# Altium project PC110.PrjPcb (part 5 of 5)

## Sheet DockStation.SchDoc
size 840 x 594 mm
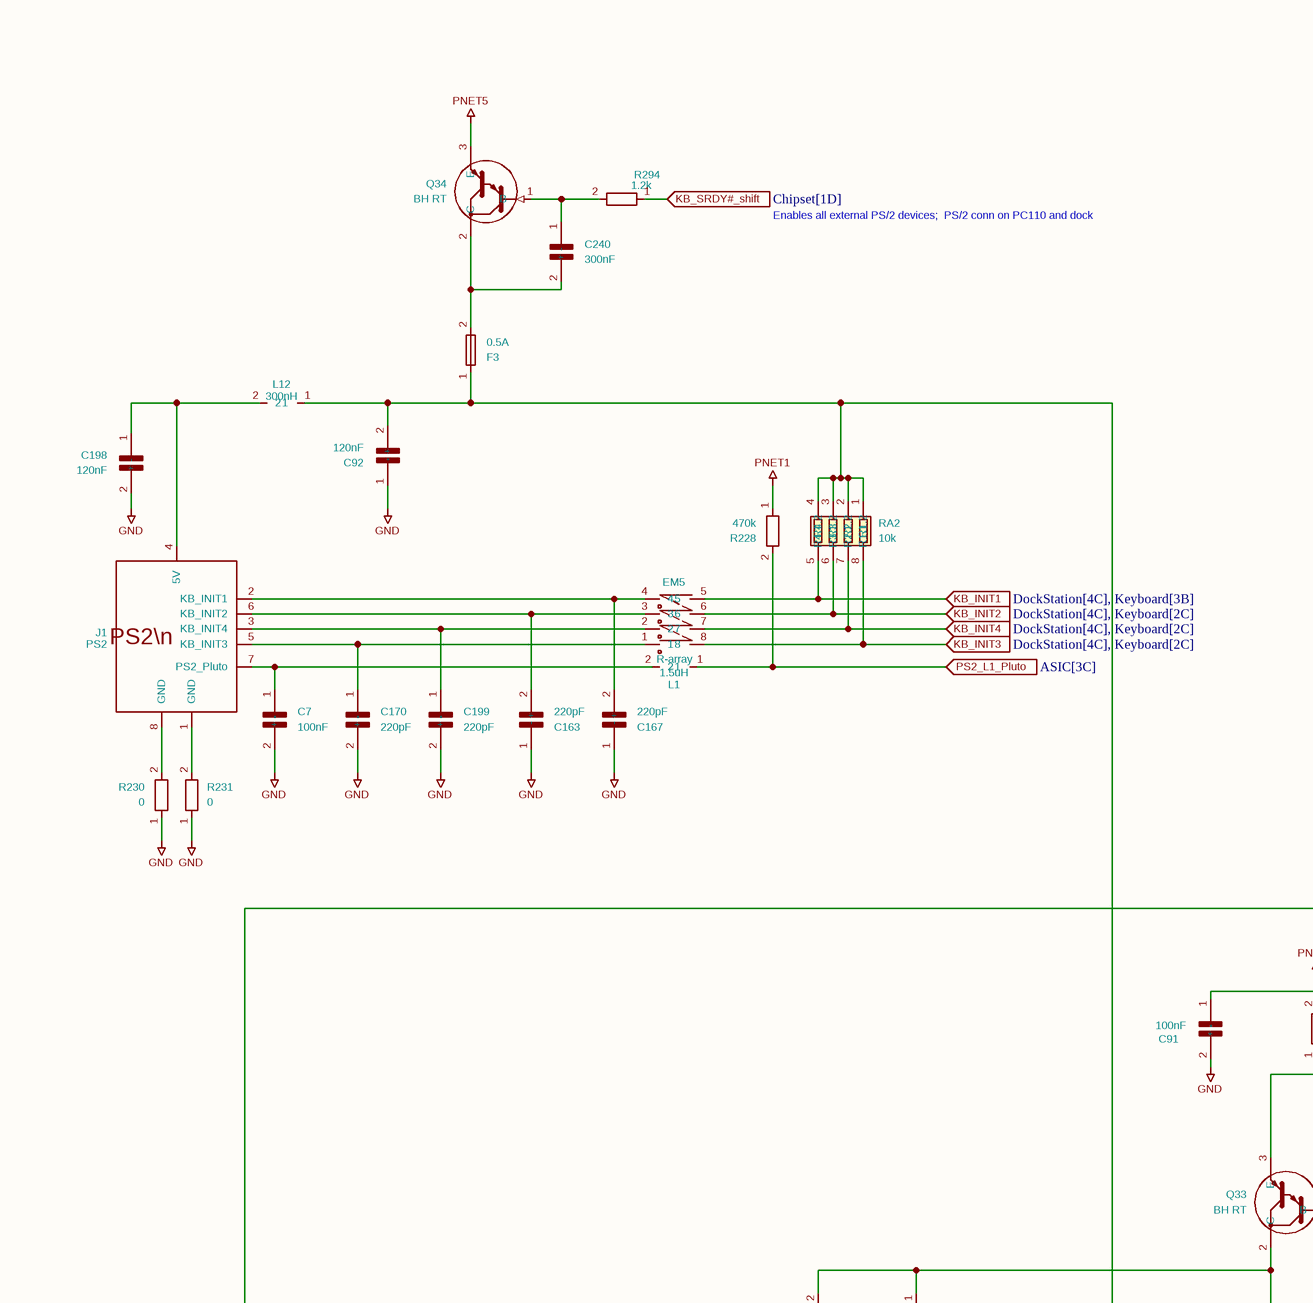
[diagram p46: DockStation.SchDoc, top left]
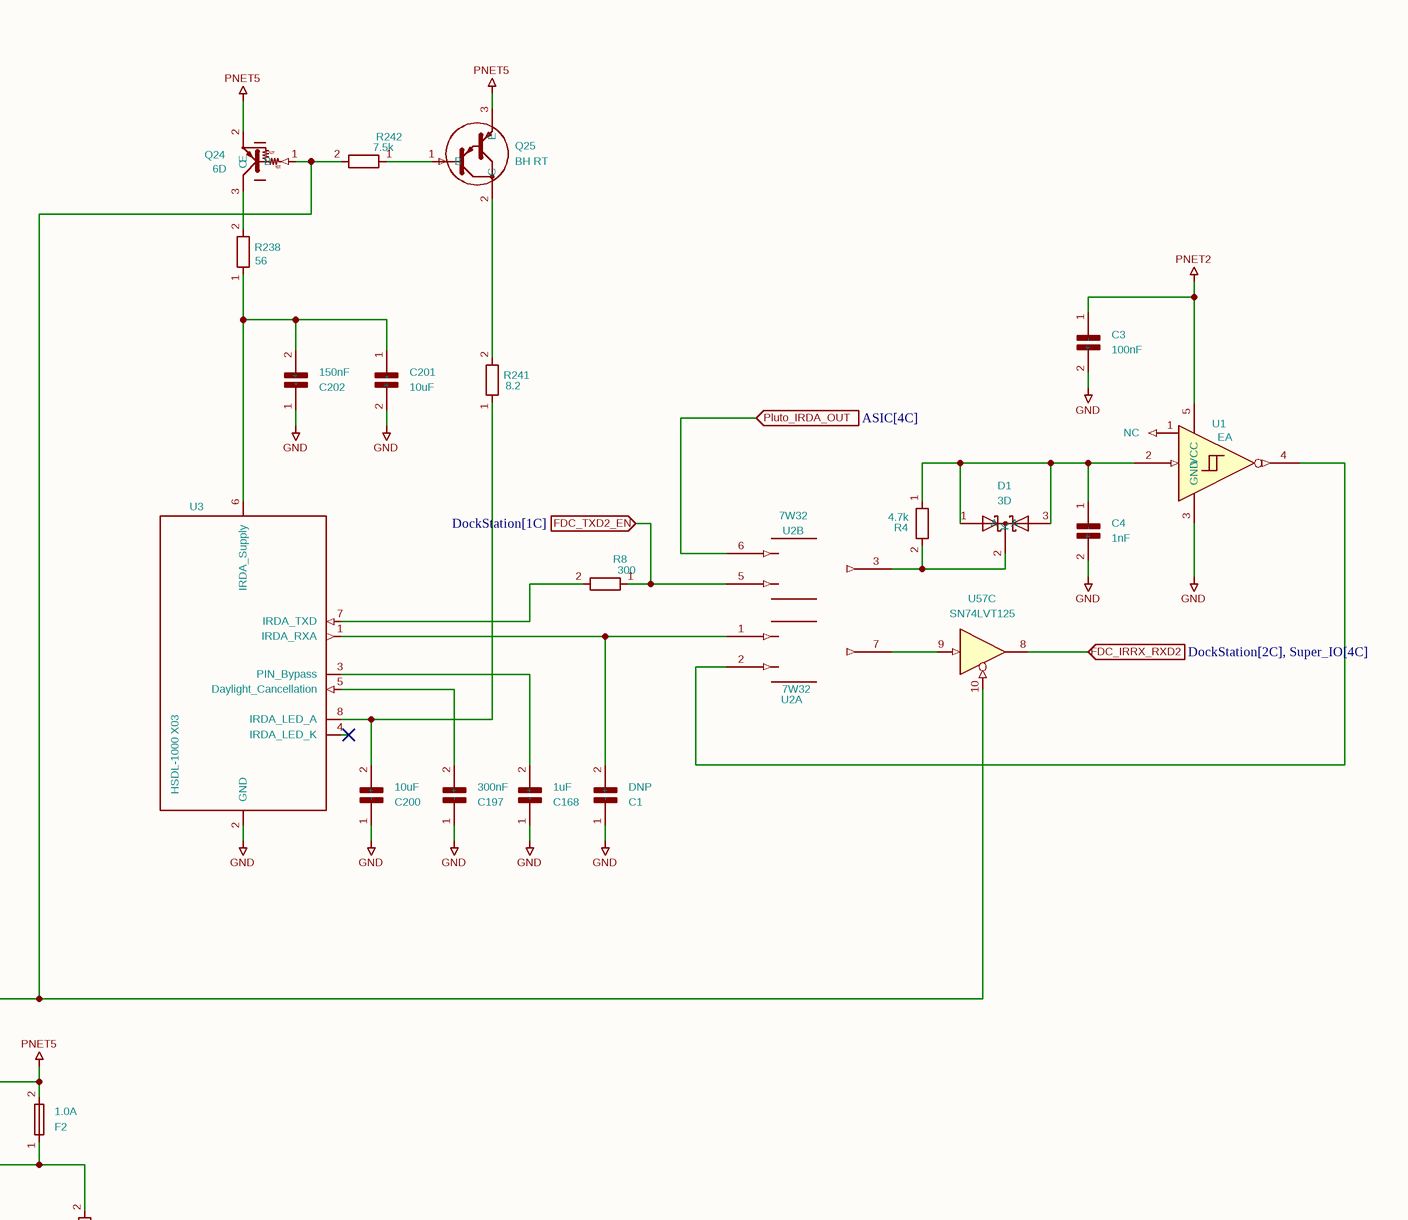
[diagram p47: DockStation.SchDoc, top middle]
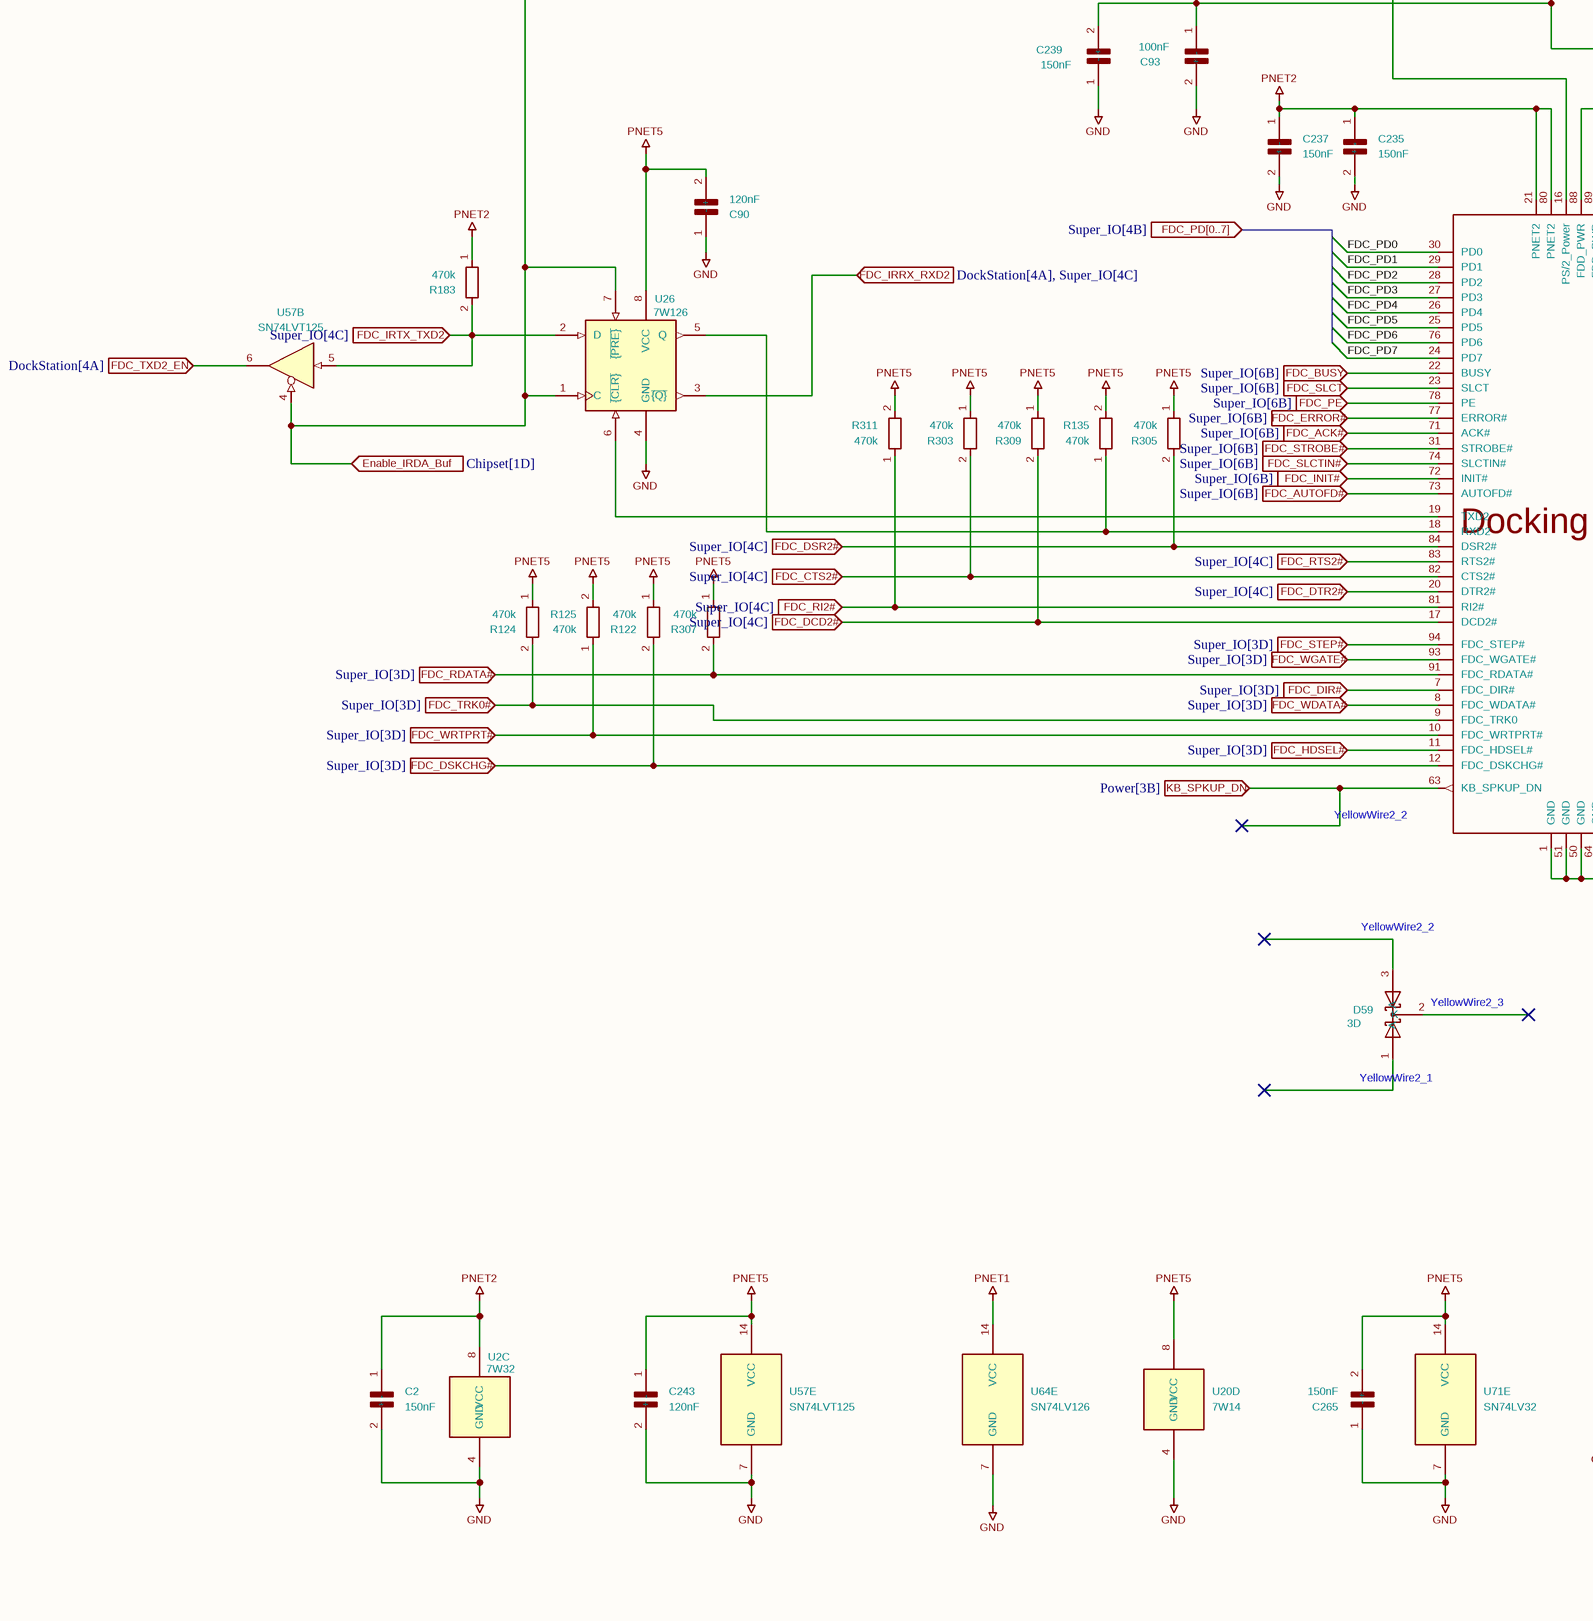
[diagram p48: DockStation.SchDoc, bottom left]
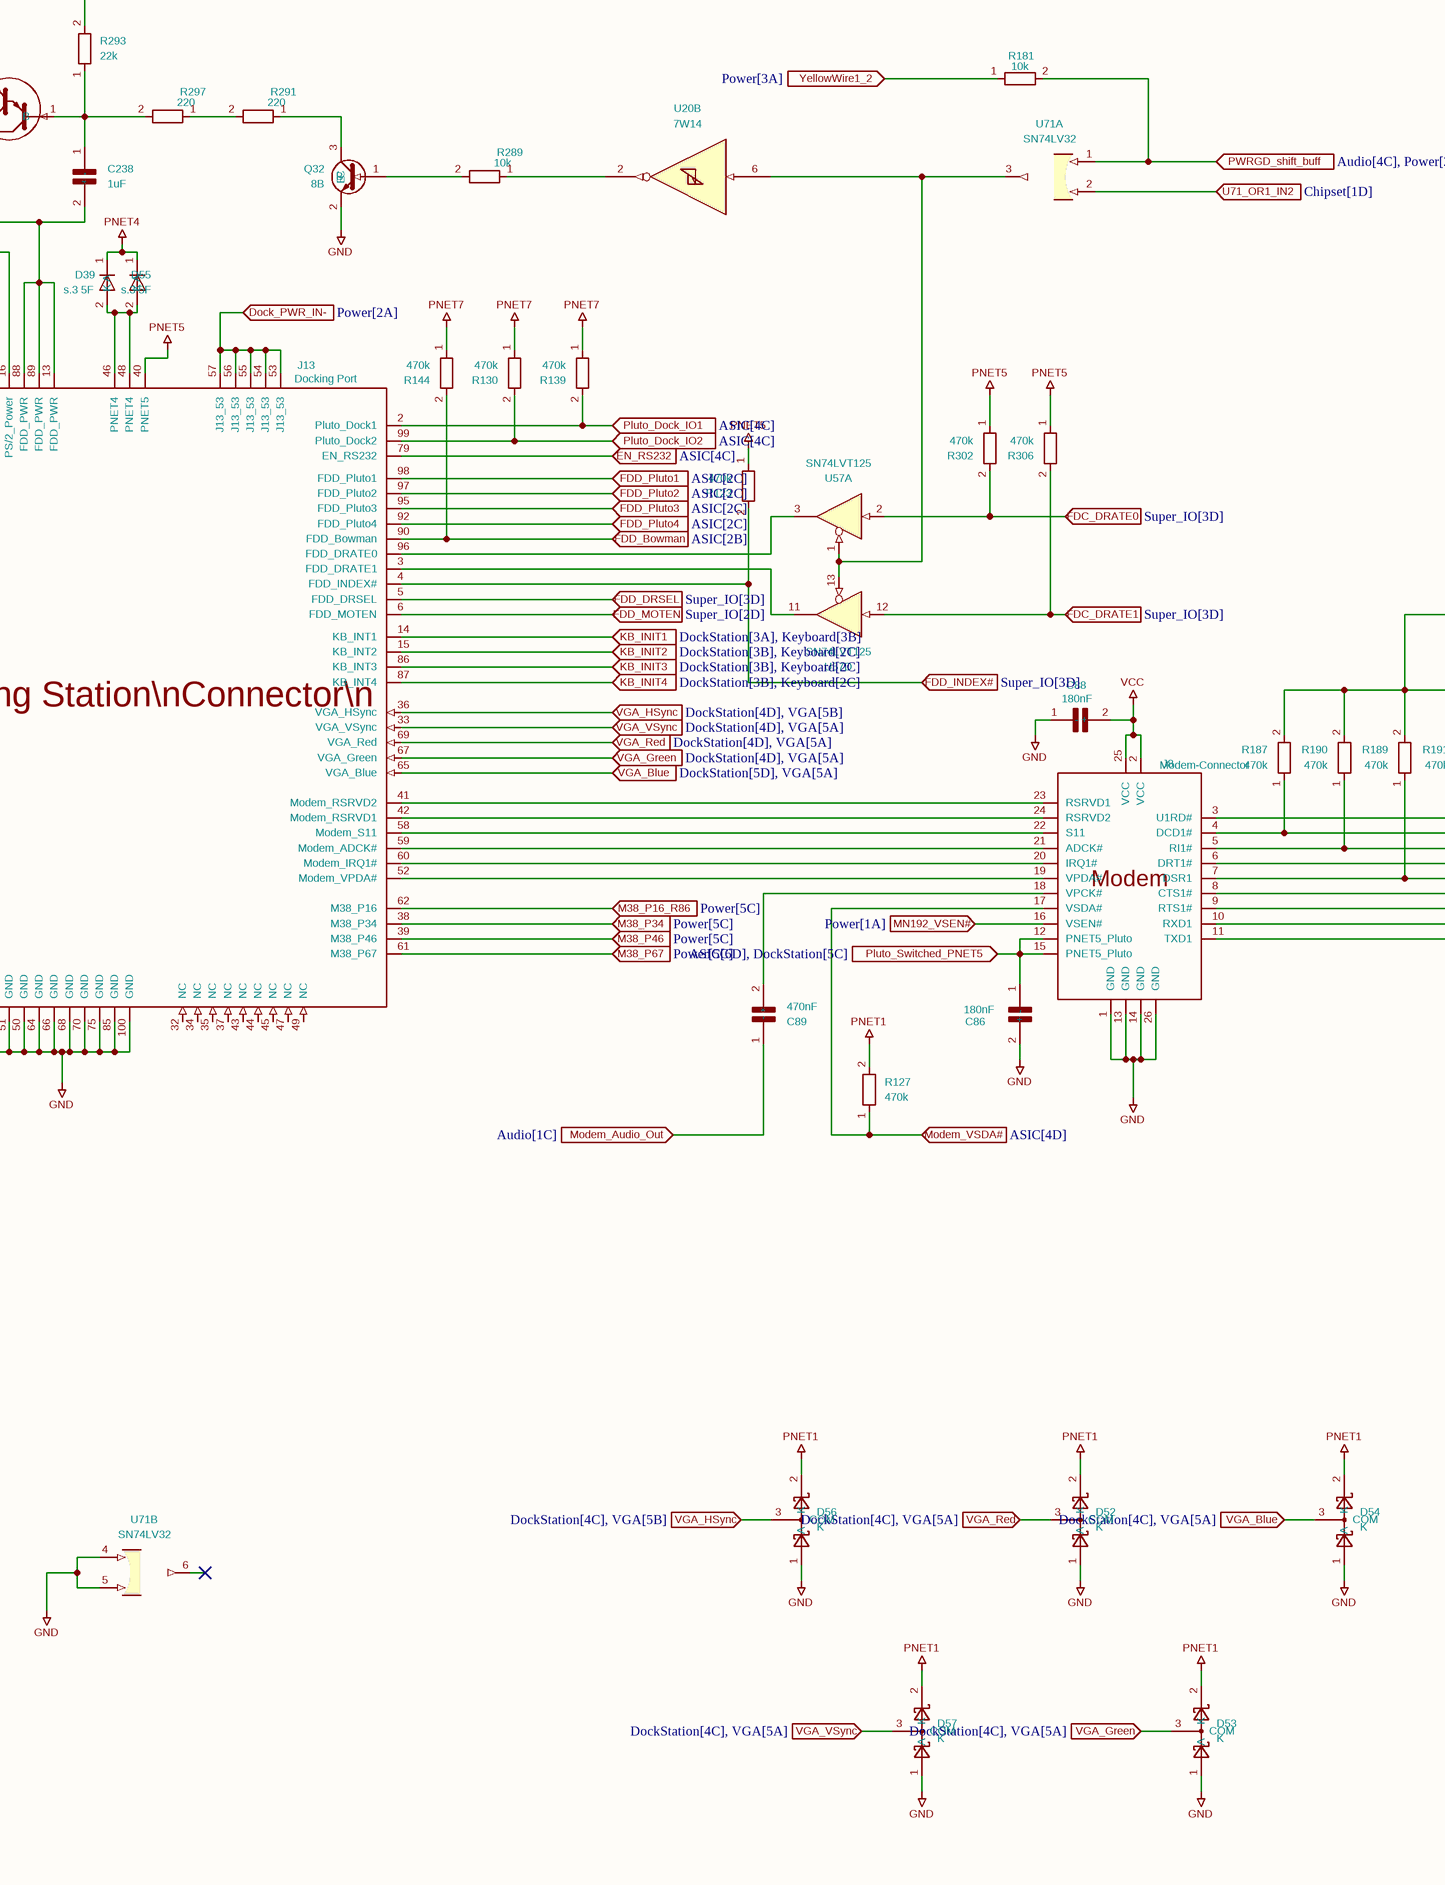
[diagram p49: DockStation.SchDoc, bottom middle]
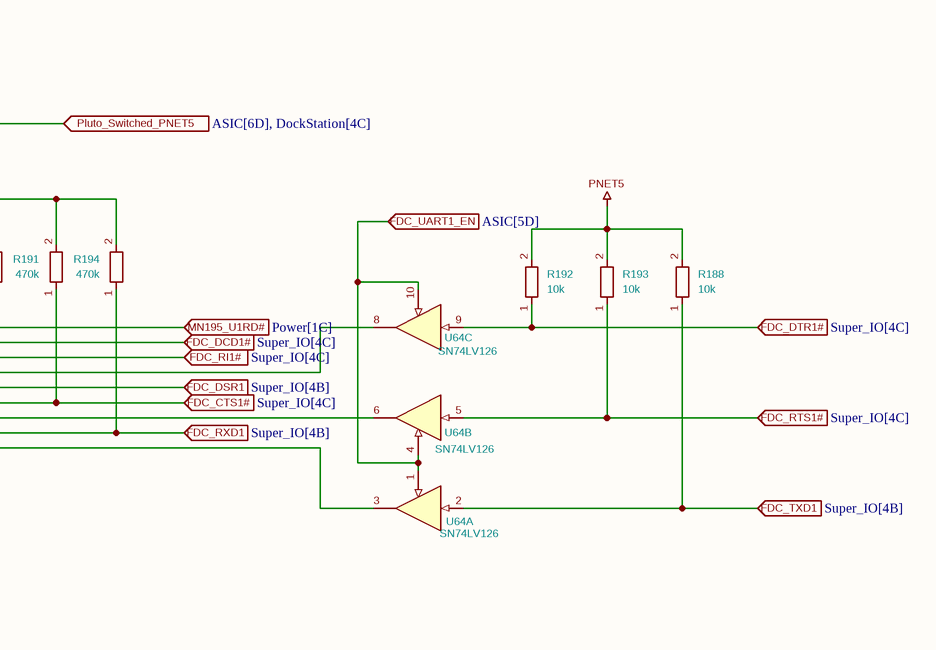
[diagram p50: DockStation.SchDoc, bottom right]

### Parts
C1  DNP  [C_0402_1005Metric]
C2  150nF  [C_0402_1005Metric]
C3  100nF  [C_0402_1005Metric]
C4  1nF  [C_0402_1005Metric]
C7  100nF  [C_0402_1005Metric]
C86  180nF  [C_0402_1005Metric]
C88  180nF  [C_0402_1005Metric]
C89  470nF  [C_0603_1608Metric]
C90  120nF  [C_0402_1005Metric]
C91  100nF  [C_0402_1005Metric]
C92  120nF  [C_0402_1005Metric]
C93  100nF  [C_0402_1005Metric]
C163  220pF  [C_0402_1005Metric]
C167  220pF  [C_0402_1005Metric]
C168  1uF  [C_0603_1608Metric]
C170  220pF  [C_0402_1005Metric]
C197  300nF  [C_0603_1608Metric]
C198  120nF  [C_0402_1005Metric]
C199  220pF  [C_0402_1005Metric]
C200  10uF  [C_1206_3216Metric]
C201  10uF  [C_1206_3216Metric]
C202  150nF  [C_0603_1608Metric]
C235  150nF  [C_0402_1005Metric]
C237  150nF  [C_0402_1005Metric]
C238  1uF  [C_0603_1608Metric]
C239  150nF  [C_0402_1005Metric]
C240  300nF  [C_0603_1608Metric]
C243  120nF  [C_0402_1005Metric]
C265  150nF  [C_0402_1005Metric]
D1  3D  [3D]
D39  s.3 5F  [Diode]
D52  K  [SOT-416]
D53  K  [SOT-416]
D54  K  [SOT-416]
D55  s.3 5F  [Diode]
D56  K  [SOT-416]
D57  K  [SOT-416]
D59  3D  [SOT-416L]
EM5  R-array  [R-array]
F2  1.0A  [Fuse_1206_3216Metric]
F3  0.5A  [Fuse_1206_3216Metric]
J1  PS2  [PS2]
J8  Modem-Connector  [Modem-Connector]
J13  Docking Port  [Docking Port]
L1  1.5uH  [L_0603_1608Metric]
L12  300nH  [L_0805_2012Metric]
Q24  6D  [SOT-23]
Q25  BH RT  [SOT-89-3]
Q32  8B  [SOT-416]
Q33  BH RT  [SOT-89-3]
Q34  BH RT  [SOT-89-3]
R4  4.7k  [R_0402_1005Metric]
R8  300  [R_0402_1005Metric]
R122  470k  [R_0402_1005Metric]
R123  470k  [R_0402_1005Metric]
R124  470k  [R_0402_1005Metric]
R125  470k  [R_0402_1005Metric]
R127  470k  [R_0402_1005Metric]
R130  470k  [R_0402_1005Metric]
R135  470k  [R_0402_1005Metric]
R139  470k  [R_0402_1005Metric]
R144  470k  [R_0402_1005Metric]
R181  10k  [R_0402_1005Metric]
R183  470k  [R_0402_1005Metric]
R187  470k  [R_0402_1005Metric]
R188  10k  [R_0402_1005Metric]
R189  470k  [R_0402_1005Metric]
R190  470k  [R_0402_1005Metric]
R191  470k  [R_0402_1005Metric]
R192  10k  [R_0402_1005Metric]
R193  10k  [R_0402_1005Metric]
R194  470k  [R_0402_1005Metric]
R228  470k  [R_0402_1005Metric]
R230  0  [R_0805_2012Metric]
R231  0  [R_0603_1608Metric]
R238  56  [R_0603_1608Metric]
R241  8.2  [R_1206_3216Metric_Pad1.30x1.75mm_HandSolder]
R242  7.5k  [R_0402_1005Metric]
R289  10k  [R_0402_1005Metric]
R291  220  [R_0402_1005Metric]
R293  22k  [R_0402_1005Metric]
R294  1.2k  [R_0402_1005Metric]
R297  220  [R_0402_1005Metric]
R302  470k  [R_0402_1005Metric]
R303  470k  [R_0402_1005Metric]
R305  470k  [R_0402_1005Metric]
R306  470k  [R_0402_1005Metric]
R307  470k  [R_0402_1005Metric]
R309  470k  [R_0402_1005Metric]
R311  470k  [R_0402_1005Metric]
RA2  10k  [R-array]
U1  EA  [SOT-353]
U2  7W32  [sso-8]  (parts A,B,C of 3)
U3  HSDL-1000 X03  [IRDA]
U20  7W14  [sso-8]  (parts B,D of 4)
U26  7W126  [sso-8]
U57  SN74LVT125  [TSSOP-14_4.4x5mm_P0.65mm]  (parts A,B,C,D,E of 5)
U64  SN74LV126  [TSSOP-14_4.4x5mm_P0.65mm]  (parts A,B,C,E of 5)
U71  SN74LV32  [TSSOP-14_4.4x5mm_P0.65mm]  (parts A,B,E of 5)

### Ports
Dock_PWR_IN- (in, see Power[2A]), EN_RS232 (in, see ASIC[4C]), Enable_IRDA_Buf (in, see Chipset[1D]), FDC_ACK# (in, see Super_IO[6B]), FDC_AUTOFD# (in, see Super_IO[6B]), FDC_BUSY (in, see Super_IO[6B]), FDC_CTS1# (in, see Super_IO[4C]), FDC_CTS2# (in, see Super_IO[4C]), FDC_DCD1# (in, see Super_IO[4C]), FDC_DCD2# (in, see Super_IO[4C]), FDC_DIR# (in, see Super_IO[3D]), FDC_DRATE0 (in, see Super_IO[3D]), FDC_DRATE1 (in, see Super_IO[3D]), FDC_DSKCHG# (in, see Super_IO[3D]), FDC_DSR1 (in, see Super_IO[4B]), FDC_DSR2# (in, see Super_IO[4C]), FDC_DTR1# (in, see Super_IO[4C]), FDC_DTR2# (in, see Super_IO[4C]), FDC_ERROR# (in, see Super_IO[6B]), FDC_HDSEL# (in, see Super_IO[3D]), FDC_INIT# (in, see Super_IO[6B]), FDC_IRRX_RXD2 (in, see DockStation[2C], Super_IO[4C]), FDC_IRRX_RXD2 (in, see DockStation[4A], Super_IO[4C]), FDC_IRTX_TXD2 (in, see Super_IO[4C]), FDC_PD[0..7] (in, see Super_IO[4B]), FDC_PE (in, see Super_IO[6B]), FDC_RDATA# (in, see Super_IO[3D]), FDC_RI1# (in, see Super_IO[4C]), FDC_RI2# (in, see Super_IO[4C]), FDC_RTS1# (in, see Super_IO[4C]), FDC_RTS2# (in, see Super_IO[4C]), FDC_RXD1 (in, see Super_IO[4B]), FDC_SLCT (in, see Super_IO[6B]), FDC_SLCTIN# (in, see Super_IO[6B]), FDC_STEP# (in, see Super_IO[3D]), FDC_STROBE# (in, see Super_IO[6B]), FDC_TRK0# (in, see Super_IO[3D]), FDC_TXD1 (in, see Super_IO[4B]), FDC_TXD2_EN (in, see DockStation[1C]), FDC_TXD2_EN (in, see DockStation[4A]), FDC_UART1_EN (in, see ASIC[5D]), FDC_WDATA# (in, see Super_IO[3D]), FDC_WGATE# (in, see Super_IO[3D]), FDC_WRTPRT# (in, see Super_IO[3D]), FDD_Bowman (in, see ASIC[2B]), FDD_DRSEL (in, see Super_IO[3D]), FDD_INDEX# (in, see Super_IO[3D]), FDD_MOTEN (in, see Super_IO[2D]), FDD_Pluto1 (in, see ASIC[2C]), FDD_Pluto2 (in, see ASIC[2C]), FDD_Pluto3 (in, see ASIC[2C]), FDD_Pluto4 (in, see ASIC[2C]), KB_INIT1 (in, see DockStation[3A], Keyboard[3B]), KB_INIT1 (in, see DockStation[4C], Keyboard[3B]), KB_INIT2 (in, see DockStation[3B], Keyboard[2C]), KB_INIT2 (in, see DockStation[4C], Keyboard[2C]), KB_INIT3 (in, see DockStation[3B], Keyboard[2C]), KB_INIT3 (in, see DockStation[4C], Keyboard[2C]), KB_INIT4 (in, see DockStation[3B], Keyboard[2C]), KB_INIT4 (in, see DockStation[4C], Keyboard[2C]), KB_SPKUP_DN (in, see Power[3B]), KB_SRDY#_shift (in, see Chipset[1D]), M38_P16_R86 (in, see Power[5C]), M38_P34 (in, see Power[5C]), M38_P46 (in, see Power[5C]), M38_P67 (in, see Power[5C]), MN192_VSEN# (in, see Power[1A]), MN195_U1RD# (in, see Power[1C]), Modem_Audio_Out (in, see Audio[1C]), Modem_VSDA# (in, see ASIC[4D]), Pluto_Dock_IO1 (in, see ASIC[4C]), Pluto_Dock_IO2 (in, see ASIC[4C]), Pluto_IRDA_OUT (in, see ASIC[4C]), Pluto_Switched_PNET5 (in, see ASIC[6D], DockStation[4C]), Pluto_Switched_PNET5 (in, see ASIC[6D], DockStation[5C]), PS2_L1_Pluto (in, see ASIC[3C]), PWRGD_shift_buff (in, see Audio[4C], Power[2C], Power[5C], ROM[6B]), U71_OR1_IN2 (in, see Chipset[1D]), VGA_Blue (in, see DockStation[4C], VGA[5A]), VGA_Blue (in, see DockStation[5D], VGA[5A]), VGA_Green (in, see DockStation[4C], VGA[5A]), VGA_Green (in, see DockStation[4D], VGA[5A]), VGA_HSync (in, see DockStation[4C], VGA[5B]), VGA_HSync (in, see DockStation[4D], VGA[5B]), VGA_Red (in, see DockStation[4C], VGA[5A]), VGA_Red (in, see DockStation[4D], VGA[5A]), VGA_VSync (in, see DockStation[4C], VGA[5A]), VGA_VSync (in, see DockStation[4D], VGA[5A]), YellowWire1_2 (in, see Power[3A])

### Nets
GND: C1.1(+) C2.2(-) C3.2(-) C4.2(-) C7.2(-) C86.2(-) C88.1(+) C90.1(+) C91.2(-) C92.1(+) C93.2(-) C163.1(+) C167.1(+) C168.1(+) C170.2(-) C197.1(+) C198.2(-) C199.2(-) C200.1(+) C201.2(-) C202.1(+) C235.2(-) C237.2(-) C239.1(+) C243.2(-) C265.1(+) D52.1(A) D53.1(A) D54.1(A) D56.1(A) D57.1(A) J8.1(GND) J8.13(GND) J8.14(GND) J8.26(GND) J13.1(GND) J13.50(GND) J13.51(GND) J13.64(GND) J13.66(GND) J13.68(GND) J13.70(GND) J13.75(GND) J13.85(GND) J13.100(GND) Q32.2(E) R230.1 R231.1 U1.3(GND) U2.4(GND) U3.2(GND) U20.4(GND) U26.4(GND) U57.7(GND) U64.7(GND) U71.4 U71.5 U71.7(GND)
PNET1: D52.2(K) D53.2(K) D54.2(K) D56.2(K) D57.2(K) R127.2 R228.1 U64.14(VCC)
PNET2: C2.1(+) C3.1(+) C235.1(+) C237.1(+) J13.21(PNET2) J13.80(PNET2) R183.1 U1.5(VCC) U2.8(VCC)
PNET4: D39.1(K) D55.1(K)
PNET5: C90.2(-) C91.1(+) C243.1(+) C265.2(-) F2.2 J13.40(PNET5) Q24.2(E) Q25.3(E) Q34.3(E) R122.1 R123.1 R124.1 R125.2 R135.2 R188.2 R192.2 R193.2 R302.1 R303.1 R305.1 R306.1 R307.1 R309.1 R311.2 U20.8(VCC) U26.8(VCC) U57.14(VCC) U71.14(VCC)
PNET7: R130.1 R139.1 R144.1
VCC: C88.2(-) J8.2(VCC) J8.25(VCC)
Dock_PWR_IN-: J13.53(J13_53) J13.54(J13_53) J13.55(J13_53) J13.56(J13_53) J13.57(J13_53) ; port Dock_PWR_IN-
EN_RS232: J13.79(EN_RS232) ; port EN_RS232
Enable_IRDA_Buf: Q24.1(B) R242.2 U26.1(C) U26.7(~{{PRE}}) U57.4 U57.10 ; port Enable_IRDA_Buf
FDC_ACK#: J13.71(ACK#) ; port FDC_ACK#
FDC_AUTOFD#: J13.73(AUTOFD#) ; port FDC_AUTOFD#
FDC_BUSY: J13.22(BUSY) ; port FDC_BUSY
FDC_CTS1#: J8.8(CTS1#) R191.1 ; port FDC_CTS1#
FDC_CTS2#: J13.82(CTS2#) R303.2 ; port FDC_CTS2#
FDC_DCD1#: J8.4(DCD1#) R187.1 ; port FDC_DCD1#
FDC_DCD2#: J13.17(DCD2#) R309.2 ; port FDC_DCD2#
FDC_DIR#: J13.7(FDC_DIR#) ; port FDC_DIR#
FDC_DRATE0: R302.2 U57.2 ; port FDC_DRATE0
FDC_DRATE1: R306.2 U57.12 ; port FDC_DRATE1
FDC_DSKCHG#: J13.12(FDC_DSKCHG#) R122.2 ; port FDC_DSKCHG#
FDC_DSR1: J8.7(DSR1) R189.1 ; port FDC_DSR1
FDC_DSR2#: J13.84(DSR2#) R305.2 ; port FDC_DSR2#
FDC_DTR1#: R192.1 U64.9 ; port FDC_DTR1#
FDC_DTR2#: J13.20(DTR2#) ; port FDC_DTR2#
FDC_ERROR#: J13.77(ERROR#) ; port FDC_ERROR#
FDC_HDSEL#: J13.11(FDC_HDSEL#) ; port FDC_HDSEL#
FDC_INIT#: J13.72(INIT#) ; port FDC_INIT#
FDC_IRRX_RXD2: U26.3(~{{Q}}) U57.8 ; port FDC_IRRX_RXD2
FDC_IRTX_TXD2: R183.2 U26.2(D) U57.5 ; port FDC_IRTX_TXD2
FDC_PD0: J13.30(PD0)
FDC_PD1: J13.29(PD1)
FDC_PD2: J13.28(PD2)
FDC_PD3: J13.27(PD3)
FDC_PD4: J13.26(PD4)
FDC_PD5: J13.25(PD5)
FDC_PD6: J13.76(PD6)
FDC_PD7: J13.24(PD7)
FDC_PE: J13.78(PE) ; port FDC_PE
FDC_RDATA#: J13.91(FDC_RDATA#) R307.2 ; port FDC_RDATA#
FDC_RI1#: J8.5(RI1#) R190.1 ; port FDC_RI1#
FDC_RI2#: J13.81(RI2#) R311.1 ; port FDC_RI2#
FDC_RTS1#: R193.1 U64.5 ; port FDC_RTS1#
FDC_RTS2#: J13.83(RTS2#) ; port FDC_RTS2#
FDC_RXD1: J8.10(RXD1) R194.1 ; port FDC_RXD1
FDC_SLCT: J13.23(SLCT) ; port FDC_SLCT
FDC_SLCTIN#: J13.74(SLCTIN#) ; port FDC_SLCTIN#
FDC_STEP#: J13.94(FDC_STEP#) ; port FDC_STEP#
FDC_STROBE#: J13.31(STROBE#) ; port FDC_STROBE#
FDC_TRK0#: J13.9(FDC_TRK0) R124.2 ; port FDC_TRK0#
FDC_TXD1: R188.1 U64.2 ; port FDC_TXD1
FDC_TXD2_EN: R8.1 U2.5 U57.6 ; port FDC_TXD2_EN
FDC_UART1_EN: U64.1 U64.4 U64.10 ; port FDC_UART1_EN
FDC_WDATA#: J13.8(FDC_WDATA#) ; port FDC_WDATA#
FDC_WGATE#: J13.93(FDC_WGATE#) ; port FDC_WGATE#
FDC_WRTPRT#: J13.10(FDC_WRTPRT#) R125.1 ; port FDC_WRTPRT#
FDD_Bowman: J13.90(FDD_Bowman) R144.2 ; port FDD_Bowman
FDD_DRSEL: J13.5(FDD_DRSEL) ; port FDD_DRSEL
FDD_INDEX#: J13.4(FDD_INDEX#) R123.2 ; port FDD_INDEX#
FDD_MOTEN: J13.6(FDD_MOTEN) ; port FDD_MOTEN
FDD_Pluto1: J13.98(FDD_Pluto1) ; port FDD_Pluto1
FDD_Pluto2: J13.97(FDD_Pluto2) ; port FDD_Pluto2
FDD_Pluto3: J13.95(FDD_Pluto3) ; port FDD_Pluto3
FDD_Pluto4: J13.92(FDD_Pluto4) ; port FDD_Pluto4
KB_INIT1: EM5.5 J13.14(KB_INT1) RA2.5(R4.2) ; port KB_INIT1
KB_INIT2: EM5.6 J13.15(KB_INT2) RA2.6(R3.2) ; port KB_INIT2
KB_INIT3: EM5.8 J13.86(KB_INT3) RA2.8(R1.2) ; port KB_INIT3
KB_INIT4: EM5.7 J13.87(KB_INT4) RA2.7(R2.2) ; port KB_INIT4
KB_SPKUP_DN: J13.63(KB_SPKUP_DN) ; port KB_SPKUP_DN
KB_SRDY#_shift: R294.1 ; port KB_SRDY#_shift
M38_P16_R86: J13.62(M38_P16) ; port M38_P16_R86
M38_P34: J13.38(M38_P34) ; port M38_P34
M38_P46: J13.39(M38_P46) ; port M38_P46
M38_P67: J13.61(M38_P67) ; port M38_P67
MN192_VSEN#: J8.16(VSEN#) ; port MN192_VSEN#
MN195_U1RD#: J8.3(U1RD#) ; port MN195_U1RD#
Modem_Audio_Out: C89.1(+) ; port Modem_Audio_Out
Modem_VSDA#: J8.17(VSDA#) R127.1 ; port Modem_VSDA#
Pluto_Dock_IO1: J13.2(Pluto_Dock1) R139.2 ; port Pluto_Dock_IO1
Pluto_Dock_IO2: J13.99(Pluto_Dock2) R130.2 ; port Pluto_Dock_IO2
Pluto_IRDA_OUT: U2.6 ; port Pluto_IRDA_OUT
Pluto_Switched_PNET5: C86.1(+) J8.12(PNET5_Pluto) J8.15(PNET5_Pluto) R187.2 R189.2 R190.2 R191.2 R194.2 ; port Pluto_Switched_PNET5
PS2_L1_Pluto: L1.1 R228.2 ; port PS2_L1_Pluto
PWRGD_shift_buff: R181.2 U71.1 ; port PWRGD_shift_buff
U71_OR1_IN2: U71.2 ; port U71_OR1_IN2
VGA_Blue: D54.3(COM) J13.65(VGA_Blue) ; port VGA_Blue
VGA_Green: D53.3(COM) J13.67(VGA_Green) ; port VGA_Green
VGA_HSync: D56.3(COM) J13.36(VGA_HSync) ; port VGA_HSync
VGA_Red: D52.3(COM) J13.69(VGA_Red) ; port VGA_Red
VGA_VSync: D57.3(COM) J13.33(VGA_VSync) ; port VGA_VSync
YellowWire1_2: R181.1 ; port YellowWire1_2
NetC1_2: C1.2(-) U2.1 U3.1(IRDA_RXA)
NetC4_1: C4.1(+) D1.1(A) D1.3(A) R4.1 U1.2
NetC7_1: C7.1(+) J1.7(PS2_Pluto) L1.2
NetC89_2: C89.2(-) J8.18(VPCK#)
NetC92_2: C92.2(-) F3.1 J13.16(PS/2_Power) L12.1 RA2.1(R1.1) RA2.2(R2.1) RA2.3(R3.1) RA2.4(R4.1)
NetC93_1: C93.1(+) C238.2(-) C239.2(-) J13.13(FDD_PWR) J13.88(FDD_PWR) J13.89(FDD_PWR) Q33.2(C)
NetC163_2: C163.2(-) EM5.3 J1.6(KB_INIT2)
NetC167_2: C167.2(-) EM5.4 J1.2(KB_INIT1)
NetC168_2: C168.2(-) U3.3(PIN_Bypass)
NetC170_1: C170.1(+) EM5.1 J1.5(KB_INIT3)
NetC197_2: C197.2(-) U3.5(Daylight_Cancellation)
NetC198_1: C198.1(+) J1.4(5V) L12.2
NetC199_1: C199.1(+) EM5.2 J1.3(KB_INIT4)
NetC200_2: C200.2(-) R241.1 U3.8(IRDA_LED_A)
NetC201_1: C201.1(+) C202.2(-) R238.1 U3.6(IRDA_Supply)
NetC238_1: C238.1(+) Q33.1(B) R293.1 R297.2
NetC240_1: C240.1(+) Q34.1(B) R294.2
NetC240_2: C240.2(-) F3.2 Q34.2(C)
NetD1_2: D1.2(K) R4.2 U2.3
NetD39_2: D39.2(A) D55.2(A) J13.46(PNET4) J13.48(PNET4)
NetF2_1: F2.1 Q33.3(E) R293.2
NetJ1_1: J1.1(GND) R231.2
NetJ1_8: J1.8(GND) R230.2
NetJ8_6: J8.6(DRT1#) U64.8
NetJ8_9: J8.9(RTS1#) U64.6
NetJ8_11: J8.11(TXD1) U64.3
NetJ8_19: J8.19(VPDA#) J13.52(Modem_VPDA#)
NetJ8_20: J8.20(IRQ1#) J13.60(Modem_IRQ1#)
NetJ8_21: J8.21(ADCK#) J13.59(Modem_ADCK#)
NetJ8_22: J8.22(S11) J13.58(Modem_S11)
NetJ8_23: J8.23(RSRVD1) J13.41(Modem_RSRVD2)
NetJ8_24: J8.24(RSRVD2) J13.42(Modem_RSRVD1)
NetJ13_3: J13.3(FDD_DRATE1) U57.11
NetJ13_18: J13.18(RXD2) R135.1 U26.5(Q)
NetJ13_19: J13.19(TXD2) U26.6(~{{CLR}})
NetJ13_96: J13.96(FDD_DRATE0) U57.3
NetQ24_3: Q24.3(C) R238.2
NetQ25_1: Q25.1(B) R242.1
NetQ25_2: Q25.2(C) R241.2
NetQ32_1: Q32.1(B) R289.2
NetQ32_3: Q32.3(C) R291.1
NetR8_2: R8.2 U3.7(IRDA_TXD)
NetR289_1: R289.1 U20.2
NetR291_2: R291.2 R297.1
NetU1_4: U1.4 U2.2
NetU2_7: U2.7 U57.9
NetU20_6: U20.6 U57.1 U57.13 U71.3

Not connected (* = marked no-connect by the designer): D59 1(A)* 2(K)* 3(A)*; J13 32(NC) 34(NC) 35(NC) 37(NC) 43(NC) 44(NC) 45(NC) 47(NC) 49(NC); U1 1(NC); U3 4(IRDA_LED_K)*; U71 6*

### Notes on the sheet
- Enables all external PS/2 devices;
  PS/2 conn on PC110 and dock
- (near J13) YellowWire2_2
- (near D59) YellowWire2_2
- (near D59) YellowWire2_3
- (near D59) YellowWire2_1
- 1
- 2
- 3
- 4
- 5
- 6
- 7
- 8
- 9
- 10
- 11
- 12
- 13
- 14
- 15
- 16
- A
- B
- C
- D
- E
- F
- G
- H
- I
- J
- K
- Title: PC110
- File: DockStation.kicad_sch
- Sheet: /
- Recreated by: Ahmad Byagowi
- KiCad E.D.A.  kicad (5.1.4)-1
- Size: A1
- Date:
- Rev:
- Id: 1/1
- (in symbol Dock_Conn) Docking Station\nConnector\n
- (in symbol DTA114Y) 47k; 10k
- (in symbol Modem_Conn) Modem
- (in symbol PS2_Conn) PS2\n

### Library data of the parts
C1-C4 C7 C86 C88-C93 C163 C167 C168 C170 C197-C202 C235 C237-C240 C243 C265 = C
  C1: Value: DNP; Footprint: Capacitor_SMD:C_0402_1005Metric
  C2 C235 C237 C239 C265: Value: 150nF; Footprint: Capacitor_SMD:C_0402_1005Metric
  C3 C7 C91 C93: Value: 100nF; Footprint: Capacitor_SMD:C_0402_1005Metric
  C4: Value: 1nF; Footprint: Capacitor_SMD:C_0402_1005Metric
  C86 C88: Value: 180nF; Footprint: Capacitor_SMD:C_0402_1005Metric
  C89: Value: 470nF; Footprint: Capacitor_SMD:C_0603_1608Metric
  C90 C92 C198 C243: Value: 120nF; Footprint: Capacitor_SMD:C_0402_1005Metric
  C163 C167 C170 C199: Value: 220pF; Footprint: Capacitor_SMD:C_0402_1005Metric
  C168 C238: Value: 1uF; Footprint: Capacitor_SMD:C_0603_1608Metric
  C197 C240: Value: 300nF; Footprint: Capacitor_SMD:C_0603_1608Metric
  C200 C201: Value: 10uF; Footprint: Capacitor_SMD:C_1206_3216Metric
  C202: Value: 150nF; Footprint: Capacitor_SMD:C_0603_1608Metric
D1 D59 = D_Schottky_Dual_CommonCathode_AKA: Value: 3D
  D1: Footprint: PC110:3D
  D59: Footprint: PC110:SOT-416L
D39 D55 = D: Value: s.3 5F; Footprint: PC110:Diode
D52-D54 D56 D57 = BAT54SW: Value: K; Footprint: Package_TO_SOT_SMD:SOT-416
EM5 = EMI_filter_Array: Value: R-array; Footprint: PC110:R-array
F2 F3 = Fuse: Footprint: Fuse:Fuse_1206_3216Metric
  F2: Value: 1.0A
  F3: Value: 0.5A
J1 = PS2_Conn: Value: PS2; Footprint: PC110:PS2
J8 = Modem_Conn: Value: Modem-Connector; Footprint: PC110:Modem-Connector
J13 = Dock_Conn: Value: Docking Port; Footprint: PC110:Docking Port
L1 L12 = L
  L1: Value: 1.5uH; Footprint: Inductor_SMD:L_0603_1608Metric
  L12: Value: 300nH; Footprint: Inductor_SMD:L_0805_2012Metric
Q24 = DTA114Y: Value: 6D; Footprint: PCM_Package_TO_SOT_SMD_AKL:SOT-23
Q25 Q33 Q34 = Q_PNP_Darlington_Generic_BCE: Value: BH RT; Footprint: Package_TO_SOT_SMD:SOT-89-3
Q32 = Q_NPN_Generic_BEC: Value: 8B; Footprint: Package_TO_SOT_SMD:SOT-416
R4 R8 R122-R125 R127 R130 R135 R139 R144 R181 R183 R187-R194 R228 R230 R231 R238 R241 R242 R289 R291 R293 R294 R297 R302 R303 R305-R307 R309 R311 = R
  R4: Value: 4.7k; Footprint: PCM_Resistor_SMD_AKL:R_0402_1005Metric
  R8: Value: 300; Footprint: PCM_Resistor_SMD_AKL:R_0402_1005Metric
  R122-R125 R127 R130 R135 R139 R144 R183 R187 R189-R191 R194 R228: Value: 470k; Footprint: PCM_Resistor_SMD_AKL:R_0402_1005Metric
  R181 R188 R192 R193: Value: 10k; Footprint: PCM_Resistor_SMD_AKL:R_0402_1005Metric
  R230: Value: 0; Footprint: PCM_Resistor_SMD_AKL:R_0805_2012Metric
  R231: Value: 0; Footprint: PCM_Resistor_SMD_AKL:R_0603_1608Metric
  R238: Value: 56; Footprint: Resistor_SMD:R_0603_1608Metric
  R241: Value: 8.2; Footprint: Resistor_SMD:R_1206_3216Metric_Pad1.30x1.75mm_HandSolder
  R242: Value: 7.5k; Footprint: PCM_Resistor_SMD_AKL:R_0402_1005Metric
  R289: Value: 10k; Footprint: Resistor_SMD:R_0402_1005Metric
  R291 R297: Value: 220; Footprint: Resistor_SMD:R_0402_1005Metric
  R293: Value: 22k; Footprint: Resistor_SMD:R_0402_1005Metric
  R294: Value: 1.2k; Footprint: Resistor_SMD:R_0402_1005Metric
  R302 R303 R305-R307 R309 R311: Value: 470k; Footprint: Resistor_SMD:R_0402_1005Metric
RA2 = R_Pack04: Value: 10k; Footprint: PC110:R-array
U1 = 74AHC1G14: Value: EA; Footprint: PC110:SOT-353
U2 = 74LVC2G32: Value: 7W32; Footprint: PC110:sso-8
U3 = IRDA: Value: HSDL-1000 X03; Footprint: PC110:IRDA
U20 = 74LVC3G14: Value: 7W14; Footprint: PC110:sso-8
U26 = 74AUC1G74: Value: 7W126; Footprint: PC110:sso-8
U57 = 74LS125: Value: SN74LVT125; Footprint: Package_SO:TSSOP-14_4.4x5mm_P0.65mm
U64 = 74LS126: Value: SN74LV126; Footprint: Package_SO:TSSOP-14_4.4x5mm_P0.65mm
U71 = 74LS32: Value: SN74LV32; Footprint: Package_SO:TSSOP-14_4.4x5mm_P0.65mm

## Sheet Clock.SchDoc
size 420 x 297 mm
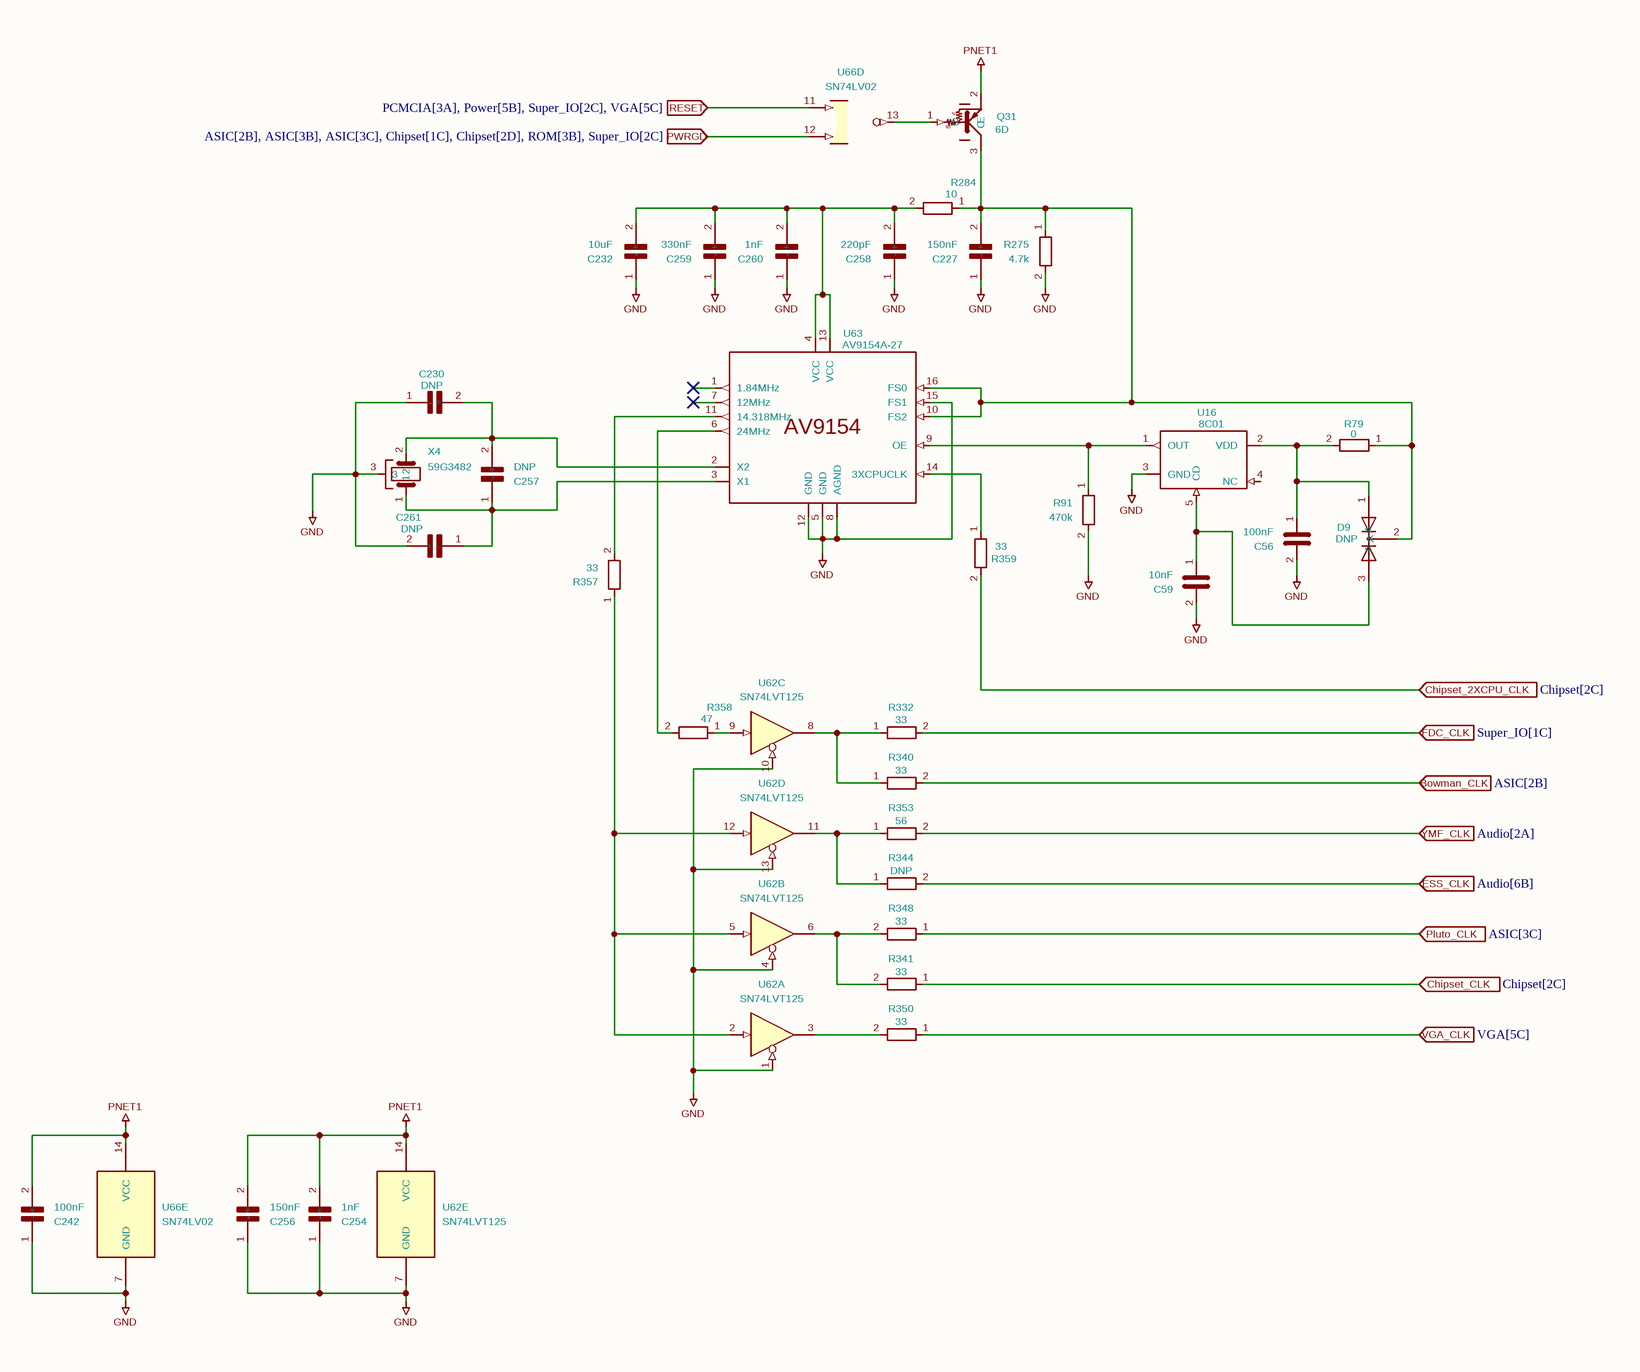
[diagram p51: Clock.SchDoc]

### Parts
C56  100nF  [C_0402_1005Metric]
C59  10nF  [C_0603_1608Metric]
C227  150nF  [C_0402_1005Metric]
C230  DNP  [C_0402_1005Metric]
C232  10uF  [C_1206_3216Metric]
C242  100nF  [C_0402_1005Metric]
C254  1nF  [C_0402_1005Metric]
C256  150nF  [C_0402_1005Metric]
C257  DNP  [C_0402_1005Metric]
C258  220pF  [C_0402_1005Metric]
C259  330nF  [C_0603_1608Metric]
C260  1nF  [C_0402_1005Metric]
C261  DNP  [C_0402_1005Metric]
D9  DNP  [3D]
Q31  6D  [SOT-23]
R79  0  [R_0402_1005Metric]
R91  470k  [R_0402_1005Metric]
R275  4.7k  [R_0402_1005Metric]
R284  10  [R_0805_2012Metric]
R332  33  [R_0402_1005Metric]
R340  33  [R_0402_1005Metric]
R341  33  [R_0402_1005Metric]
R344  DNP  [R_0402_1005Metric]
R348  33  [R_0402_1005Metric]
R350  33  [R_0402_1005Metric]
R353  56  [R_0402_1005Metric]
R357  33  [R_0402_1005Metric]
R358  47  [R_0402_1005Metric]
R359  33  [R_0402_1005Metric]
U16  8C01  [SOT-23-5]
U62  SN74LVT125  [TSSOP-14_4.4x5mm_P0.65mm]  (parts A,B,C,D,E of 5)
U63  AV9154A-27  [SOIC-16W]
U66  SN74LV02  [TSSOP-14_4.4x5mm_P0.65mm]  (parts D,E of 5)
X4  59G3482  [XTAL-6]

### Ports
Bowman_CLK (in, see ASIC[2B]), Chipset_2XCPU_CLK (in, see Chipset[2C]), Chipset_CLK (in, see Chipset[2C]), ESS_CLK (in, see Audio[6B]), FDC_CLK (in, see Super_IO[1C]), Pluto_CLK (in, see ASIC[3C]), PWRGD (in, see ASIC[2B], ASIC[3B], ASIC[3C], Chipset[1C], Chipset[2D], ROM[3B], Super_IO[2C]), RESET (in, see PCMCIA[3A], Power[5B], Super_IO[2C], VGA[5C]), VGA_CLK (in, see VGA[5C]), YMF_CLK (in, see Audio[2A])

### Nets
GND: C56.2 C59.2 C227.1(+) C230.1(+) C232.1(+) C242.1(+) C254.1(+) C256.1(+) C258.1(+) C259.1(+) C260.1(+) C261.2(-) R91.2 R275.2 U16.3(GND) U62.1 U62.4 U62.7(GND) U62.10 U62.13 U63.5(GND) U63.8(AGND) U63.12(GND) U63.15(FS1) U66.7(GND) X4.3
PNET1: C242.2(-) C254.2(-) C256.2(-) Q31.2(E) U62.14(VCC) U66.14(VCC)
Bowman_CLK: R340.2 ; port Bowman_CLK
Chipset_2XCPU_CLK: R359.2 ; port Chipset_2XCPU_CLK
Chipset_CLK: R341.1 ; port Chipset_CLK
ESS_CLK: R344.2 ; port ESS_CLK
FDC_CLK: R332.2 ; port FDC_CLK
Pluto_CLK: R348.1 ; port Pluto_CLK
PWRGD: U66.12 ; port PWRGD
RESET: U66.11 ; port RESET
VGA_CLK: R350.1 ; port VGA_CLK
YMF_CLK: R353.2 ; port YMF_CLK
NetC56_1: C56.1 D9.1(A) R79.2 U16.2(VDD)
NetC59_1: C59.1 D9.3(A) U16.5(CD)
NetC227_2: C227.2(-) D9.2(K) Q31.3(C) R79.1 R275.1 R284.1 U63.10(FS2) U63.16(FS0)
NetC230_2: C230.2(-) C257.2(-) U63.2(X2) X4.2
NetC232_2: C232.2(-) C258.2(-) C259.2(-) C260.2(-) R284.2 U63.4(VCC) U63.13(VCC)
NetC257_1: C257.1(+) C261.1(+) U63.3(X1) X4.1
NetQ31_1: Q31.1(B) U66.13
NetR91_1: R91.1 U16.1(OUT) U63.9(OE)
NetR332_1: R332.1 R340.1 U62.8
NetR341_2: R341.2 R348.2 U62.6
NetR344_1: R344.1 R353.1 U62.11
NetR350_2: R350.2 U62.3
NetR357_1: R357.1 U62.2 U62.5 U62.12
NetR357_2: R357.2 U63.11(14.318MHz)
NetR358_1: R358.1 U62.9
NetR358_2: R358.2 U63.6(24MHz)
NetR359_1: R359.1 U63.14(3XCPUCLK)

Not connected (* = marked no-connect by the designer): U16 4(NC); U63 1(1.84MHz)* 7(12MHz)*

### Notes on the sheet
- 1
- 2
- 3
- 4
- 5
- 6
- 7
- 8
- A
- B
- C
- D
- E
- Title: PC110
- File: Clock.kicad_sch
- Sheet: /
- Recreated by: Ahmad Byagowi
- F
- KiCad E.D.A.  kicad (5.1.4)-1
- Size: A3
- Date:
- Rev:
- Id: 1/1
- (in symbol DTA114Y) 47k; 10k

### Library data of the parts
C56 C59 C227 C230 C232 C242 C254 C256-C261 = C
  C56 C242: Value: 100nF; Footprint: Capacitor_SMD:C_0402_1005Metric
  C59: Value: 10nF; Footprint: Capacitor_SMD:C_0603_1608Metric
  C227 C256: Value: 150nF; Footprint: Capacitor_SMD:C_0402_1005Metric
  C230 C257 C261: Value: DNP; Footprint: Capacitor_SMD:C_0402_1005Metric
  C232: Value: 10uF; Footprint: Capacitor_SMD:C_1206_3216Metric
  C254 C260: Value: 1nF; Footprint: Capacitor_SMD:C_0402_1005Metric
  C258: Value: 220pF; Footprint: Capacitor_SMD:C_0402_1005Metric
  C259: Value: 330nF; Footprint: Capacitor_SMD:C_0603_1608Metric
D9 = D_Dual_CommonCathode_AKA: Value: DNP; Footprint: PC110:3D
Q31 = DTA114Y: Value: 6D; Footprint: PCM_Package_TO_SOT_SMD_AKL:SOT-23
R79 R91 R275 R284 R332 R340 R341 R344 R348 R350 R353 R357-R359 = R
  R79: Value: 0; Footprint: PCM_Resistor_SMD_AKL:R_0402_1005Metric
  R91: Value: 470k; Footprint: PCM_Resistor_SMD_AKL:R_0402_1005Metric
  R275: Value: 4.7k; Footprint: PCM_Resistor_SMD_AKL:R_0402_1005Metric
  R284: Value: 10; Footprint: PCM_Resistor_SMD_AKL:R_0805_2012Metric
  R332 R340 R341 R348 R350 R357 R359: Value: 33; Footprint: PCM_Resistor_SMD_AKL:R_0402_1005Metric
  R344: Value: DNP; Footprint: PCM_Resistor_SMD_AKL:R_0402_1005Metric
  R353: Value: 56; Footprint: PCM_Resistor_SMD_AKL:R_0402_1005Metric
  R358: Value: 47; Footprint: PCM_Resistor_SMD_AKL:R_0402_1005Metric
U16 = QC01: Value: 8C01; Footprint: Package_TO_SOT_SMD:SOT-23-5
U62 = 74LS125: Value: SN74LVT125; Footprint: Package_SO:TSSOP-14_4.4x5mm_P0.65mm
U63 = AV9154: Value: AV9154A-27; Footprint: PC110:SOIC-16W
U66 = 74LS02: Value: SN74LV02; Footprint: Package_SO:TSSOP-14_4.4x5mm_P0.65mm
X4 = Crystal_GND3: Value: 59G3482; Footprint: PC110:XTAL-6

## Nets that join several sheets
GND: Processor (71 pins), Power (86 pins), PCMCIA (83 pins), Memory (23 pins), Chipset (42 pins), ASIC (47 pins), Keyboard (26 pins), VGA (88 pins), Super_IO (12 pins), Storage (72 pins), Audio (72 pins), ROM (11 pins), DockStation (58 pins), Clock (26 pins)
PNET1: Processor (62 pins), Power (16 pins), PCMCIA (14 pins), Memory (26 pins), Chipset (22 pins), ASIC (51 pins), Keyboard (11 pins), VGA (30 pins), Super_IO (8 pins), Storage (R161.2 R173.1 R292.1), Audio (8 pins), DockStation (8 pins), Clock (6 pins)
PNET2: Power (Q11.3 R107.2 R108.1 R354.2), ASIC (U21.99), Audio (18 pins), DockStation (9 pins)
PNET4: Power (D6.2 J5.3 J5.4 J5.38), DockStation (D39.1 D55.1)
PNET5: Power (8 pins), PCMCIA (6 pins), Chipset (C35.2 U7.24), ASIC (Q16.2), Keyboard (Q8.1 U72.24), VGA (Q1.2), Super_IO (9 pins), Audio (15 pins), ROM (U60.5), DockStation (28 pins)
PNET7: Power (Q13.3 R97.2 R98.1 R313.1), PCMCIA (9 pins), Chipset (6 pins), ASIC (5 pins), Super_IO (R319.1), Storage (10 pins), ROM (8 pins), DockStation (R130.1 R139.1 R144.1)
VCC: Power (32 pins), Chipset (D58.2), DockStation (C88.2 J8.2 J8.25)
AEN: PCMCIA (U74.K1), Chipset (U61.G16), ASIC (U21.114 U35.6), Keyboard (U69.6), Super_IO (U22.44)
BIOS_SA17: ASIC (U35.54), ROM (U59.40)
Bowman1: Chipset (U61.N9), ASIC (U21.45)
Bowman2: Chipset (U61.P9), ASIC (U21.140)
Bowman3: Chipset (U61.R9), ASIC (R149.2)
Bowman4: Chipset (U61.T9), ASIC (U21.52)
Bowman5: Chipset (R57.1 U7.3 U61.T13), ASIC (U21.130)
Bowman5_Buff: Chipset (U7.22), ROM (U60.1)
Bowman_Audio_Vol_Dn: ASIC (U21.128), Audio (U48.7)
Bowman_Audio_Vol_Up: ASIC (U21.127), Audio (U48.2)
Bowman_CLK: ASIC (U21.40), Clock (R340.2)
Bowman_ESS_DACK1#: ASIC (U21.122), Keyboard (R372.2 U72.10)
CF_CD1_Pluto: ASIC (U35.27), Storage (J11.2 R173.2)
CF_CD2_Pluto: ASIC (U35.26), Storage (J11.49 R161.1)
Chipset_2XCPU_CLK: Chipset (U61.R2), Clock (R359.2)
Chipset_32KHz: Chipset (U61.T10), ASIC (U21.51), VGA (U51.J2)
Chipset_BIOS_CE#: Chipset (U61.G15), ROM (U59.22)
Chipset_CLK: Chipset (U61.R15), Clock (R341.1)
Chipset_CPU_CLK: Processor (R252.1), Chipset (R251.1 U61.K1), ASIC (R257.2), VGA (R255.1)
Chipset_CPU_CLK_Sense: Processor (R253.2), Chipset (U61.J1)
Chipset_FDC_TC: Chipset (U61.G13), Super_IO (U22.33)
Chipset_SA16: PCMCIA (U74.J1), Chipset (U61.B16), ROM (U59.1)
Chipset_Sound: Chipset (U61.T15), Audio (R74.2)
CMOS_BATT_Sense: Power (R41.2 U6.6), Chipset (J4.4)
CPU_A20M#: Processor (J9.7 U76.B13), Chipset (U61.H3)
CPU_ADS#: Processor (U76.B3), Chipset (U61.N2), ASIC (U21.49), VGA (U51.K12)
CPU_AHOLD: Processor (J12.5 U76.A8), Chipset (U61.L5)
CPU_BE0#: Processor (J9.6 U76.B10), Chipset (U61.L1), VGA (U51.M5)
CPU_BE1#: Processor (J9.3 U76.C10), Chipset (U61.L4), VGA (U51.L13)
CPU_BE2#: Processor (J9.8 U76.A11), Chipset (U61.K3), VGA (U51.N5)
CPU_BE3#: Processor (J9.5 U76.B11), Chipset (U61.K2), VGA (U51.J9)
CPU_BLAST#: Processor (J12.1 U76.C3), Chipset (U61.N1)
CPU_BRDY#: Processor (J9.2 U76.B5), Chipset (U61.M3)
CPU_BS16#: Processor (U76.A6), VGA (U51.C11)
CPU_DC#: Processor (U76.A12), Chipset (U61.H1), ASIC (U21.41)
CPU_EADS#: Processor (J12.4 U76.A13), Chipset (U61.H2)
CPU_FLUSH#: Processor (J12.2 U76.C16), Chipset (U61.G1)
CPU_HLDA: Processor (J9.4 U76.B9), Chipset (U61.L3)
CPU_HOLD: Processor (J9.1 U76.C7), Chipset (U61.M1)
CPU_INTR: Processor (U76.D15), Chipset (U61.G2), ASIC (U21.133)
CPU_KEN#: Processor (J12.3 U76.B7), Chipset (U61.M2)
CPU_LDEV#: Chipset (U61.M4), ASIC (U21.43), VGA (U51.D11)
CPU_MIO#: Processor (U76.C11), Chipset (U61.H4), ASIC (U21.50), VGA (U51.J11)
CPU_NMI: Processor (J9.10 U76.D16), Chipset (U61.G3)
CPU_RDY#: Processor (U76.A7), Chipset (U61.L6), ASIC (U21.134), VGA (U51.C12 U51.C13)
CPU_RESET: Processor (U76.C13), Chipset (U61.G4), ASIC (U21.46)
CPU_SMI#: Processor (U76.F15), Chipset (U61.F2)
CPU_SMIACT#: Processor (U76.E16), Chipset (U61.F1), ASIC (U9.1)
CPU_SRESET: Processor (J9.9 U76.E15), Chipset (U61.F4)
CPU_STPCLK#: Processor (U76.G15), Chipset (U61.E1), ASIC (U35.62)
CPU_WR#: Processor (U76.C9), Chipset (U61.L2), ASIC (U21.42), VGA (U51.D12)
D11_2: Power (D11.3), Audio (C62.2 D12.1 R88.1 U17.2)
D28_1: Power (C221.2 D50.1 J5.12), PCMCIA (U70.7 U70.24), ROM (Q36.2)
Dock_PWR_IN-: Power (J5.5 J5.36 J5.37), DockStation (5 pins)
EN_LCD_VAA: Power (R397.1), ASIC (U35.83)
EN_RS232: ASIC (U35.77), DockStation (J13.79)
Enable_IRDA_Buf: Chipset (U7.15), DockStation (6 pins)
ESS_AEN: Keyboard (U72.16), Audio (U4.40)
ESS_CLK: Audio (R70.1), Clock (R344.2)
ESS_DACK1#: Keyboard (U72.15), Audio (U4.36)
ESS_IRQ1: Keyboard (U73.13), Audio (R29.1 U4.16)
ESS_IRQ1_Buf: ASIC (U21.118), Keyboard (U73.7)
ESS_IRQ2: Keyboard (U73.15), Audio (U4.18)
ESS_IRQ2_Buf: ASIC (U21.87), Keyboard (U73.5)
F65_ENAVEE: Power (D37.3 J5.26 R237.1), VGA (U51.E9)
FCS_IOCHRDY: PCMCIA (U74.K3), Chipset (R323.2 U61.H14), Super_IO (U22.98), Storage (J11.34 U42.47)
FCS_RESET: Chipset (U58.4), Keyboard (U72.11), Storage (J11.32 R184.1 U42.36)
FDC_ACK#: Super_IO (R136.1 U22.60), DockStation (J13.71)
FDC_AUTOFD#: Super_IO (R141.1 U22.74), DockStation (J13.73)
FDC_BUSY: Super_IO (R143.2 U22.59), DockStation (J13.22)
FDC_CLK: Super_IO (U22.18), Clock (R332.2)
FDC_CTS1#: Super_IO (U22.80), DockStation (J8.8 R191.1)
FDC_CTS2#: Super_IO (U22.90), DockStation (J13.82 R303.2)
FDC_DACK#: ASIC (U21.120), Super_IO (R118.1 U22.34)
FDC_DCD1#: Super_IO (U22.83), DockStation (J8.4 R187.1)
FDC_DCD2#: Super_IO (U22.85), DockStation (J13.17 R309.2)
FDC_DIR#: Super_IO (U22.5), DockStation (J13.7)
FDC_DRATE0: Super_IO (U22.17), DockStation (R302.2 U57.2)
FDC_DRATE1: Super_IO (U22.16), DockStation (R306.2 U57.12)
FDC_DS3: ASIC (U21.123), Keyboard (U69.1), Super_IO (U22.95)
FDC_DSKCHG#: Super_IO (U22.15), DockStation (J13.12 R122.2)
FDC_DSR1: Super_IO (U22.78), DockStation (J8.7 R189.1)
FDC_DSR2#: Super_IO (U22.88), DockStation (J13.84 R305.2)
FDC_DTR1#: Super_IO (U22.81), DockStation (R192.1 U64.9)
FDC_DTR2#: Super_IO (U22.91), DockStation (J13.20)
FDC_ERROR#: Super_IO (R142.1 U22.73), DockStation (J13.77)
FDC_FDRQ: ASIC (U21.115), Super_IO (U22.50)
FDC_FINTR: ASIC (U21.82), Super_IO (U22.38)
FDC_HDCS0#: Super_IO (U22.23), Storage (R366.2 U68.1)
FDC_HDCS1#: Super_IO (U22.24), Storage (R367.2 U68.2)
FDC_HDSEL#: Super_IO (U22.9), DockStation (J13.11)
FDC_IDE7: Super_IO (U22.20), Storage (J11.11 R369.2 U42.13)
FDC_INIT#: Super_IO (R133.1 U22.72), DockStation (J13.72)
FDC_IOW: ASIC (U35.58), Super_IO (U23.2)
FDC_IRRX_RXD2: Super_IO (R315.1 U22.86), DockStation (U26.3 U57.8)
FDC_IRTX_TXD2: Super_IO (U22.87), DockStation (R183.2 U26.2 U57.5)
FDC_MTR2#: ASIC (U21.121), Super_IO (R310.1 U22.94)
FDC_MTR3#: ASIC (U21.117), Super_IO (U22.97)
FDC_PE: Super_IO (R138.1 U22.58), DockStation (J13.78)
FDC_RDATA#: Super_IO (U22.14), DockStation (J13.91 R307.2)
FDC_RI1#: Super_IO (U22.82), DockStation (J8.5 R190.1)
FDC_RI2#: Super_IO (U22.84), DockStation (J13.81 R311.1)
FDC_RTS1#: Super_IO (U22.79), DockStation (R193.1 U64.5)
FDC_RTS2#: Super_IO (U22.89), DockStation (J13.83)
FDC_RXD1: Super_IO (U22.76), DockStation (J8.10 R194.1)
FDC_SLCT: Super_IO (R140.2 U22.57), DockStation (J13.23)
FDC_SLCTIN#: Super_IO (R132.1 U22.71), DockStation (J13.74)
FDC_STEP#: Super_IO (U22.6), DockStation (J13.94)
FDC_STROBE#: Super_IO (R137.1 U22.75), DockStation (J13.31)
FDC_TRK0#: Super_IO (U22.11), DockStation (J13.9 R124.2)
FDC_TXD1: Super_IO (U22.77), DockStation (R188.1 U64.2)
FDC_UART1_EN: ASIC (D32.1 R180.2 U35.76), DockStation (U64.1 U64.4 U64.10)
FDC_WDATA#: Super_IO (U22.7), DockStation (J13.8)
FDC_WGATE#: Super_IO (U22.8), DockStation (J13.93)
FDC_WRTPRT#: Super_IO (U22.12), DockStation (J13.10 R125.1)
FDD_Bowman: ASIC (U21.125), DockStation (J13.90 R144.2)
FDD_DRSEL: Super_IO (U22.2), DockStation (J13.5)
FDD_INDEX#: Super_IO (U22.10), DockStation (J13.4 R123.2)
FDD_MOTEN: Super_IO (U22.100), DockStation (J13.6)
FDD_Pluto1: ASIC (D28.2), DockStation (J13.98)
FDD_Pluto2: ASIC (D26.2), DockStation (J13.97)
FDD_Pluto3: ASIC (D29.2), DockStation (J13.95)
FDD_Pluto4: ASIC (D27.2), DockStation (J13.92)
IOCS16#: PCMCIA (U74.B1), Chipset (U61.J16), Super_IO (R319.2 U22.25), Storage (J11.47 U42.52)
IOR#: PCMCIA (U74.J3), Chipset (R326.2), ASIC (U21.112 U35.86), Keyboard (U67.5 U72.7), Super_IO (U22.42), Storage (R295.2 R296.1 U56.1), Audio (R364.1 U66.3 U66.5)
IOW#: PCMCIA (U74.J2), Chipset (R318.1), ASIC (U21.113 U35.89), Keyboard (U67.4 U72.8), Super_IO (U25.2), Storage (R298.2 R299.2 U56.4)
IRQ3: PCMCIA (R115.2 U74.E1), ASIC (U21.85), Super_IO (U22.35)
IRQ4: PCMCIA (R384.2 U74.F4), ASIC (U21.84), Super_IO (U22.36)
IRQ5: PCMCIA (R387.2 U74.F2), ASIC (U21.83), Super_IO (U22.92)
IRQ7: PCMCIA (R389.2 U74.G1), ASIC (U21.81), Super_IO (U22.37)
IRQ9: PCMCIA (R325.2 U74.N1), ASIC (U21.79)
IRQ10: PCMCIA (R394.2 U74.D5), ASIC (U21.78)
IRQ11: PCMCIA (R396.2 U74.B2), ASIC (U21.77)
IRQ14: PCMCIA (U74.B4), ASIC (U21.75), Storage (J11.24 R365.1 U42.46)
IRQ15: PCMCIA (R391.2 U74.C4), ASIC (U21.74)
KB_CNTR#: ASIC (U35.61), Keyboard (U67.59)
KB_INIT1: Keyboard (U67.17), DockStation (EM5.5 J13.14 RA2.5)
KB_INIT2: Keyboard (U67.16), DockStation (EM5.6 J13.15 RA2.6)
KB_INIT3: Keyboard (U67.13), DockStation (EM5.8 J13.86 RA2.8)
KB_INIT4: Keyboard (U67.12), DockStation (EM5.7 J13.87 RA2.7)
KB_IRQ1: ASIC (U21.86), Keyboard (U67.15)
KB_IRQ12: ASIC (U21.76), Keyboard (U67.14)
KB_RESET#: Power (D16.1 D16.3 R109.2), Chipset (U61.N11), ASIC (5 pins), Keyboard (C267.2 U67.19)
KB_SCLK#: Chipset (U7.8), Keyboard (R45.1 U67.9)
KB_SCLK_shift: Chipset (U7.17), Keyboard (Q8.3)
KB_SCRLED#: ASIC (U21.53), Keyboard (U67.25)
KB_Sound: Keyboard (U67.58), Audio (R78.1)
KB_SPKDN: Chipset (U61.T12), ASIC (U35.43), Keyboard (U67.30 U73.16)
KB_SPKUP: Power (Q27.3 R268.1), ASIC (U35.44), Keyboard (U67.29)
KB_SPKUP_DN: Power (R262.1), DockStation (J13.63)
KB_SRDY#: Chipset (U7.7), Keyboard (R59.1 U67.8)
KB_SRDY#_shift: Chipset (U7.18), DockStation (R294.1)
KBCCS#: ASIC (U35.60), Keyboard (U67.6)
LA17: PCMCIA (U74.A4), Chipset (U61.D13)
LA18: PCMCIA (U74.C5), Chipset (U61.C15)
LA19: PCMCIA (U74.A3), Chipset (U61.C16)
LA20: PCMCIA (U74.E6), Chipset (U61.D14)
LA21: PCMCIA (U74.A2), Chipset (U61.E13)
LA22: PCMCIA (U74.A1), Chipset (U61.D15)
LA23: PCMCIA (U74.E5), Chipset (U61.D16)
LCD_NC_L11: ASIC (U35.5), VGA (L16.2 R229.1)
LCD_STNDBY#: ASIC (R393.2 U35.93), VGA (U51.K13)
LCD_VAA: Power (C179.1 C190.1 L15.1), VGA (J2.3)
M38_21: Power (U6.55), Keyboard (U72.21)
M38_P14: Power (U6.42), Keyboard (U73.17)
M38_P14_Buf: ASIC (U21.107), Keyboard (U73.3)
M38_P15: Power (U6.41), Keyboard (U73.2)
M38_P15_Buf: ASIC (U21.106), Keyboard (U73.18)
M38_P16_R86: Power (R86.1), DockStation (J13.62)
M38_P22_R88: Power (R89.1), Keyboard (U73.8)
M38_P27_KB_SPKDN: Power (U6.31), Keyboard (U73.4)
M38_P34: Power (R356.1 U6.58), DockStation (J13.38)
M38_P35: Power (U6.57), Keyboard (U72.20)
M38_P36: Power (U6.56), Keyboard (U72.22)
M38_P41: Power (U6.23), ASIC (U21.111)
M38_P43: Power (U6.21), ASIC (U21.110)
M38_P44: Power (U6.20), Keyboard (U72.19)
M38_P46: Power (R288.2 U6.18), DockStation (J13.39)
M38_P67: Power (R60.2 U6.1), DockStation (J13.61)
MEMCS16#: PCMCIA (R316.2 U74.D3), Chipset (U61.J13), ASIC (U21.119)
MEMR#: PCMCIA (U74.B5), Chipset (R322.1), ROM (U36.16 U59.24)
MEMW#: PCMCIA (U74.D6), Chipset (R324.1), ROM (U24.1)
MIC_J17: Chipset (J4.1), Audio (R30.2)
MN192_VSEN#: Power (C226.2 R277.2 U5.11), DockStation (J8.16)
MN195_U1RD#: Power (R128.2 U5.13), DockStation (J8.3)
Modem_Audio_Out: Audio (R32.1), DockStation (C89.1)
Modem_VSDA#: ASIC (U35.75), DockStation (J8.17 R127.1)
OKI_CE#: ASIC (U21.142), ROM (U36.14)
PCMCIA_BALE: PCMCIA (U74.D1), Chipset (U61.K15)
PCMCIA_CLK: PCMCIA (R317.2), Chipset (U61.H16)
PCMCIA_CS: PCMCIA (R160.2 U38.6), Chipset (U61.R14)
PCMCIA_REFRESH: PCMCIA (U74.H1), Chipset (U61.E14)
PCMCIA_SBHE#: PCMCIA (U74.C3), Chipset (U61.F12)
PCMCIA_Sound: PCMCIA (U74.N3), Audio (C207.2 R120.2)
PCMCIA_ZEROWS#: PCMCIA (U74.L3), Chipset (U61.H15)
Pluto_50: Power (R276.1), ASIC (U35.50)
Pluto_52: Power (R85.1), ASIC (U35.52)
Pluto_72: Power (D30.1 D30.2 R156.2), ASIC (U35.72)
Pluto_73: Power (D31.1 D31.2 R152.2), ASIC (U35.73)
Pluto_BIOS_WR_EN: ASIC (U35.53), ROM (D19.3)
Pluto_CLK: ASIC (U35.65), Clock (R348.1)
Pluto_Dock_IO1: ASIC (U35.28), DockStation (J13.2 R139.2)
Pluto_Dock_IO2: ASIC (U35.29), DockStation (J13.99 R130.2)
Pluto_EN_IRDA: Chipset (U7.10), ASIC (U35.48)
Pluto_ESS_AEN: ASIC (U35.79), Keyboard (U69.2)
Pluto_IRDA_OUT: ASIC (U35.81), DockStation (U2.6)
Pluto_Switched_PNET5: ASIC (Q16.3 R129.2), DockStation (8 pins)
PS2_L1_Pluto: ASIC (U35.30), DockStation (L1.1 R228.2)
PWRGD: Chipset (U7.9 U19.6), ASIC (U21.47 U35.67 U38.3), Super_IO (R314.1 U22.56), ROM (D20.2), Clock (U66.12)
PWRGD_shift: Power (R87.2 U20.1), Chipset (U7.16), Audio (C248.1)
PWRGD_shift_buff: Power (D14.3 D15.3 U6.27 U20.7), Audio (U71.10 U71.13), ROM (U60.2), DockStation (R181.2 U71.1)
R73_2: Power (J5.15), ASIC (C66.2 R104.2)
R412_1: Power (J5.20), ASIC (R409.1 R410.1 R412.1)
RAM_ID0: Memory (J15.60 R158.1), ASIC (U35.31)
RAM_ID1: Memory (J15.31 R148.1), ASIC (U35.32)
RESET: Power (D18.1 D18.3 R110.1), PCMCIA (U74.T3), VGA (U51.K10), Super_IO (U22.55), Clock (U66.11)
RIOUT#: Power (U39.6), PCMCIA (U74.C8)
RTCBAT: Chipset (8 pins), ASIC (R119.2)
U8_1A3_KB_TP139: Power (R283.2), Keyboard (U73.6)
U8_2A1_KB_RXD: Power (R38.2), Keyboard (U73.11)
U21_97: Power (R330.1), ASIC (U21.97)
U21_98: Power (R355.2), ASIC (U21.98)
U21_101: Power (R328.2), ASIC (U21.101)
U21_102: Power (R339.1), ASIC (U21.102)
U21_103: Power (R336.2), ASIC (U21.103)
U21_104: Power (R351.2), ASIC (U21.104)
U21_105: Power (R331.1), ASIC (U21.105)
U21_131: Power (J5.27), ASIC (U21.131)
U21_139: Power (D60.1 D60.2 R349.1), ASIC (U21.139)
U30_D0: Power (R90.2 U30.2), ASIC (U35.1)
U53_2CLK: Power (R82.1 U30.3), ASIC (U35.3 U40.11)
U61_RAM_LCASL#: Memory (R272.1), Chipset (U61.D8)
U61_RAM_LCASU#: Memory (R274.1), Chipset (U61.A9)
U61_RAM_RAMWE#: Memory (R154.2), Chipset (U61.B8)
U61_RAM_RAS0: Memory (R101.2), Chipset (U61.C13)
U61_RAM_RAS2: Memory (R103.2), Chipset (U61.B13)
U61_RAM_RAS3: Memory (R106.2), Chipset (U61.A13)
U61_RAM_UCASL#: Memory (R159.2), Chipset (U61.A8)
U61_RAM_UCASU#: Memory (R261.1), Chipset (U61.D9)
U61_RTCBAT_470K: Power (Q26.3), Chipset (R248.1 U61.P10)
U71_OR1_IN2: Chipset (U7.19), DockStation (U71.2)
VGA_ADDHI: ASIC (U21.124), VGA (U51.J10)
VGA_Blue: VGA (R264.1 U51.C10), DockStation (D54.3 J13.65)
VGA_CLK: VGA (U51.K9), Clock (R350.1)
VGA_Green: VGA (R273.1 U51.A12), DockStation (D53.3 J13.67)
VGA_HSync: VGA (R53.1), DockStation (D56.3 J13.36)
VGA_Red: VGA (R267.1 U51.D9), DockStation (D52.3 J13.69)
VGA_VSync: VGA (R46.1), DockStation (D57.3 J13.33)
YellowWire1_2: Power (Q15.1), DockStation (R181.1)
YMF_CLK: Audio (U18.3), Clock (R353.2)
YMF_RD#_Buf: Keyboard (U72.18), Audio (U34.5 U71.12)
YMF_SA0_A0: Chipset (U7.14), Audio (U4.41 U34.12)
YMF_VSS_Res: Chipset (U61.P12), ASIC (Q14.3 R119.1)
YMF_WR#_Buf: Keyboard (U72.17), Audio (U34.9 U71.9)